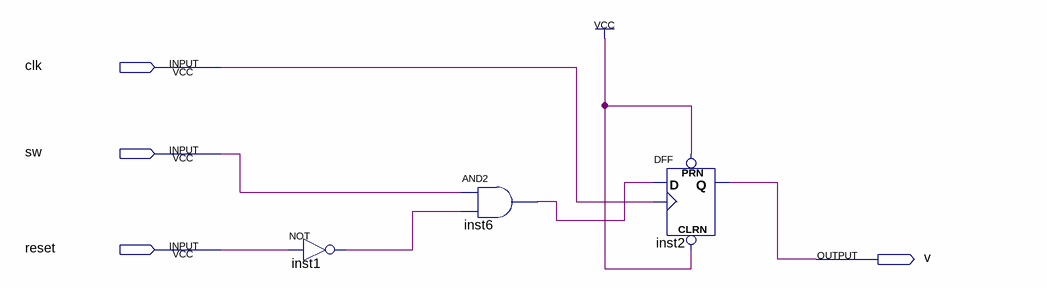
[diagram p0: schematic sheet]
// Quartus schematic Sword.bdf as structural Verilog: 3 symbols, 4 pins
module Sword (
  input  clk,
  input  sw,
  input  reset,
  output v
);

  wire inst1_out, inst6_out;

  not inst1 (inst1_out, reset);
  and inst6 (inst6_out, sw, inst1_out);
  DFF inst2 (.CLRN(1'b1), .CLK(clk), .D(inst6_out), .PRN(1'b1), .Q(v));
endmodule
